# Altium schematic sheet ELC102 - Assembly Notes.SchDoc
size Tabloid
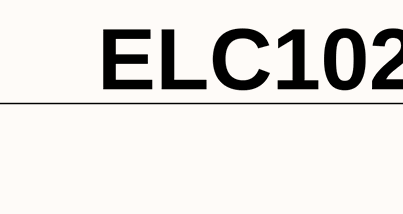
[diagram p0: ELC102 - Assembly Notes.SchDoc, top left]
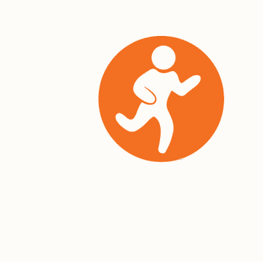
[diagram p1: ELC102 - Assembly Notes.SchDoc, top right]
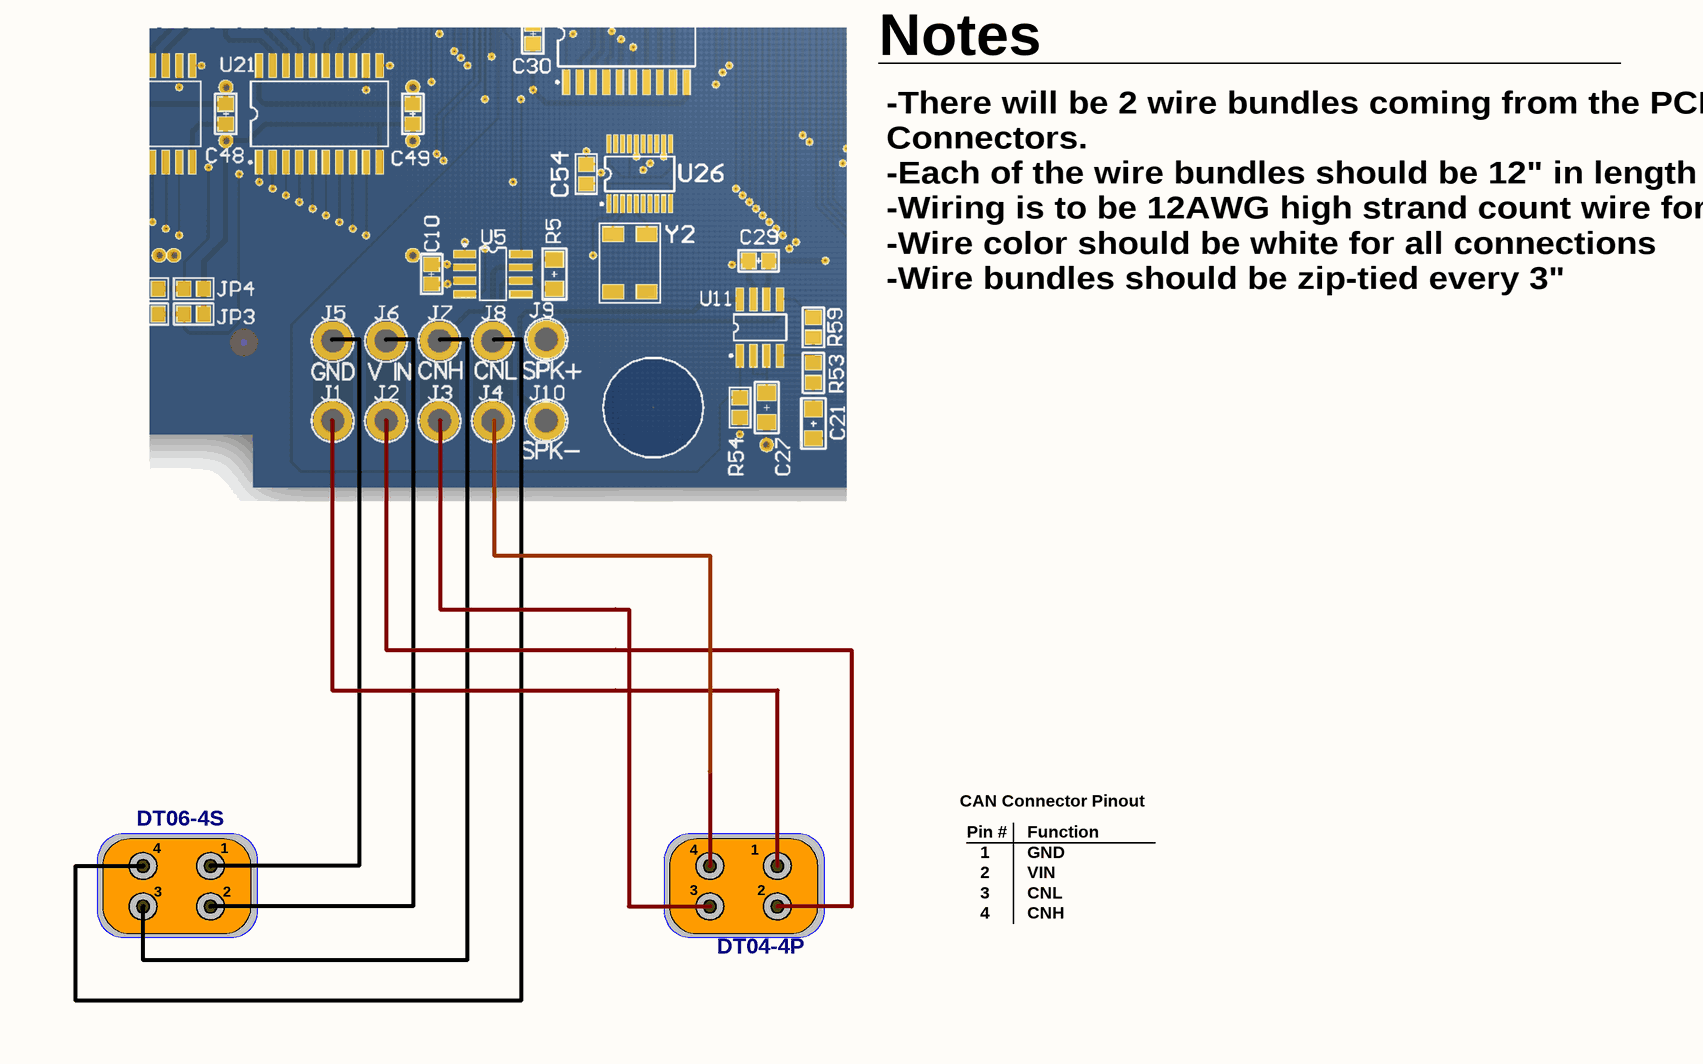
[diagram p2: ELC102 - Assembly Notes.SchDoc, bottom left]
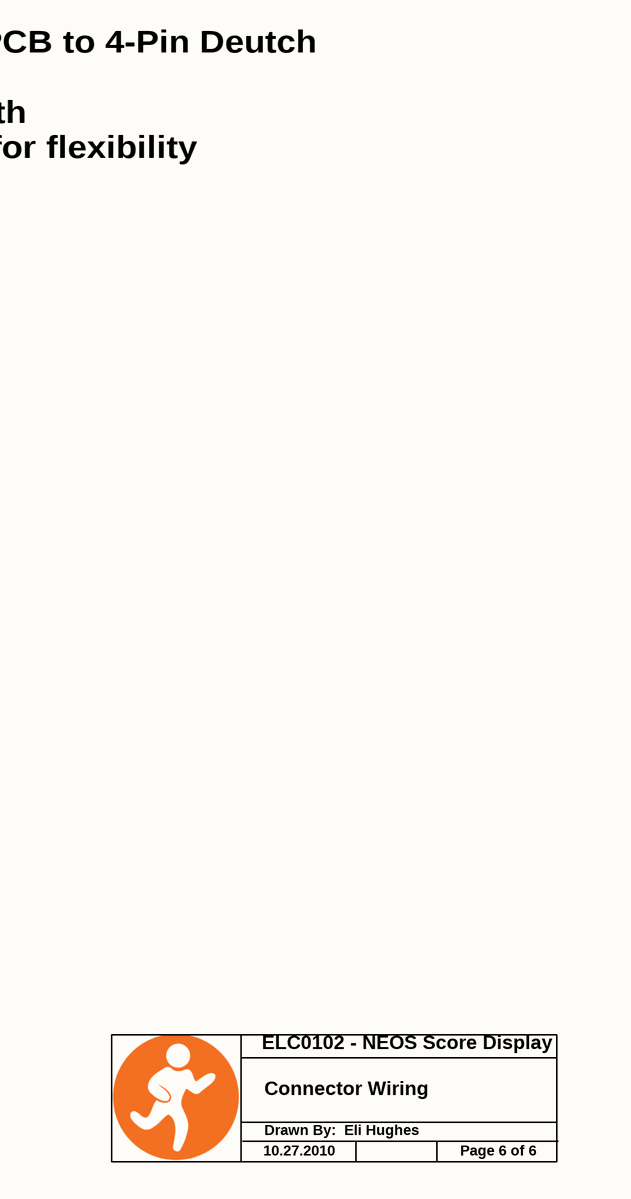
[diagram p3: ELC102 - Assembly Notes.SchDoc, bottom middle]

## Notes on the sheet
- ELC102 - Score Display - Wiring
- Notes
- -There will be 2 wire bundles coming from the PCB to 4-Pin Deutch Connectors.
  -Each of the wire bundles should be 12" in length
  -Wiring is to be 12AWG high strand count wire for flexibility
  -Wire color should be white for all connections
  -Wire bundles should be zip-tied every 3"
- DT06-4S
- 4
- 1
- CAN Connector Pinout
- Pin #
- Function
- GND
- 3
- 2
- VIN
- CNL
- CNH
- DT04-4P
- ELC0102 - NEOS Score Display
- Connector Wiring
- Drawn By:  Eli Hughes
- 10.27.2010
- Page 6 of 6